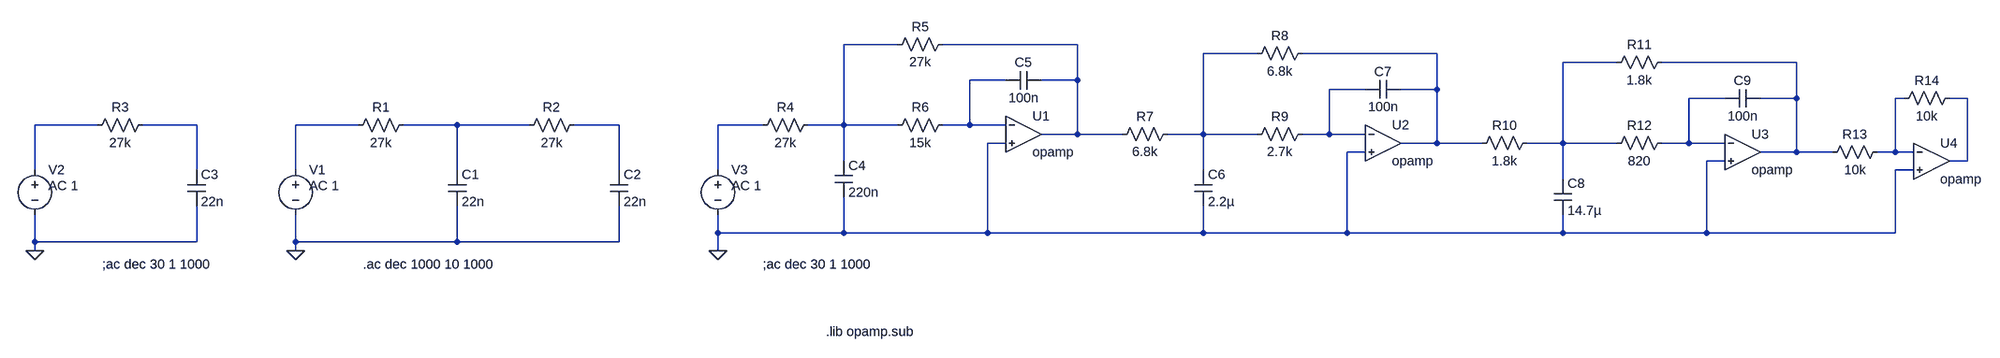
[diagram p0: schematic Cheybshev_3_Stage_Filter.asc]
Cheybshev_3_Stage_Filter.asc, the LTspice schematic file:
Version 4
SHEET 1 2932 680
WIRE 1024 -352 928 -352
WIRE 1344 -352 1104 -352
WIRE 1664 -336 1568 -336
WIRE 1984 -336 1744 -336
WIRE 2304 -320 2208 -320
WIRE 2624 -320 2384 -320
WIRE 1216 -288 1152 -288
WIRE 1344 -288 1344 -352
WIRE 1344 -288 1280 -288
WIRE 1856 -272 1792 -272
WIRE 1984 -272 1984 -336
WIRE 1984 -272 1920 -272
WIRE 2496 -256 2432 -256
WIRE 2624 -256 2624 -320
WIRE 2624 -256 2560 -256
WIRE 2816 -256 2800 -256
WIRE 2928 -256 2896 -256
WIRE -400 -208 -512 -208
WIRE -224 -208 -320 -208
WIRE 64 -208 -48 -208
WIRE 240 -208 144 -208
WIRE 368 -208 240 -208
WIRE 528 -208 448 -208
WIRE 784 -208 704 -208
WIRE 928 -208 928 -352
WIRE 928 -208 864 -208
WIRE 1024 -208 928 -208
WIRE 1152 -208 1152 -288
WIRE 1152 -208 1104 -208
WIRE 1216 -208 1152 -208
WIRE 1344 -192 1344 -288
WIRE 1344 -192 1280 -192
WIRE 1424 -192 1344 -192
WIRE 1568 -192 1568 -336
WIRE 1568 -192 1504 -192
WIRE 1664 -192 1568 -192
WIRE 1792 -192 1792 -272
WIRE 1792 -192 1744 -192
WIRE 1856 -192 1792 -192
WIRE 1216 -176 1184 -176
WIRE 1984 -176 1984 -272
WIRE 1984 -176 1920 -176
WIRE 2064 -176 1984 -176
WIRE 2208 -176 2208 -320
WIRE 2208 -176 2144 -176
WIRE 2304 -176 2208 -176
WIRE 2432 -176 2432 -256
WIRE 2432 -176 2384 -176
WIRE 2496 -176 2432 -176
WIRE 1856 -160 1824 -160
WIRE 2624 -160 2624 -256
WIRE 2624 -160 2560 -160
WIRE 2688 -160 2624 -160
WIRE 2800 -160 2800 -256
WIRE 2800 -160 2768 -160
WIRE 2832 -160 2800 -160
WIRE 928 -144 928 -208
WIRE 2496 -144 2464 -144
WIRE 2928 -144 2928 -256
WIRE 2928 -144 2896 -144
WIRE -512 -128 -512 -208
WIRE -224 -128 -224 -208
WIRE -48 -128 -48 -208
WIRE 240 -128 240 -208
WIRE 528 -128 528 -208
WIRE 704 -128 704 -208
WIRE 1568 -128 1568 -192
WIRE 2832 -128 2800 -128
WIRE 2208 -112 2208 -176
WIRE 704 -16 704 -48
WIRE 928 -16 928 -80
WIRE 928 -16 704 -16
WIRE 1184 -16 1184 -176
WIRE 1184 -16 928 -16
WIRE 1568 -16 1568 -64
WIRE 1568 -16 1184 -16
WIRE 1824 -16 1824 -160
WIRE 1824 -16 1568 -16
WIRE 2208 -16 2208 -48
WIRE 2208 -16 1824 -16
WIRE 2464 -16 2464 -144
WIRE 2464 -16 2208 -16
WIRE 2800 -16 2800 -128
WIRE 2800 -16 2464 -16
WIRE -512 0 -512 -48
WIRE -224 0 -224 -64
WIRE -224 0 -512 0
WIRE -48 0 -48 -48
WIRE 240 0 240 -64
WIRE 240 0 -48 0
WIRE 528 0 528 -64
WIRE 528 0 240 0
WIRE -512 16 -512 0
WIRE -48 16 -48 0
WIRE 704 16 704 -16
FLAG -48 16 0
FLAG -512 16 0
FLAG 704 16 0
SYMBOL voltage -48 -144 R0
WINDOW 123 24 44 Left 2
WINDOW 39 0 0 Left 0
SYMATTR InstName V1
SYMATTR Value ""
SYMATTR Value2 AC 1
SYMBOL res 160 -224 R90
WINDOW 0 0 56 VBottom 2
WINDOW 3 32 56 VTop 2
SYMATTR InstName R1
SYMATTR Value 27k
SYMBOL cap 224 -128 R0
SYMATTR InstName C1
SYMATTR Value 22n
SYMBOL res 464 -224 R90
WINDOW 0 0 56 VBottom 2
WINDOW 3 32 56 VTop 2
SYMATTR InstName R2
SYMATTR Value 27k
SYMBOL cap 512 -128 R0
SYMATTR InstName C2
SYMATTR Value 22n
SYMBOL voltage -512 -144 R0
WINDOW 123 24 44 Left 2
WINDOW 39 0 0 Left 0
SYMATTR InstName V2
SYMATTR Value ""
SYMATTR Value2 AC 1
SYMBOL res -304 -224 R90
WINDOW 0 0 56 VBottom 2
WINDOW 3 32 56 VTop 2
SYMATTR InstName R3
SYMATTR Value 27k
SYMBOL cap -240 -128 R0
SYMATTR InstName C3
SYMATTR Value 22n
SYMBOL voltage 704 -144 R0
WINDOW 123 24 44 Left 2
WINDOW 39 0 0 Left 0
SYMATTR InstName V3
SYMATTR Value ""
SYMATTR Value2 AC 1
SYMBOL Opamps\\opamp 1248 -256 R0
SYMATTR InstName U1
SYMBOL res 880 -224 R90
WINDOW 0 0 56 VBottom 2
WINDOW 3 32 56 VTop 2
SYMATTR InstName R4
SYMATTR Value 27k
SYMBOL cap 912 -144 R0
SYMATTR InstName C4
SYMATTR Value 220n
SYMBOL res 1120 -368 R90
WINDOW 0 0 56 VBottom 2
WINDOW 3 32 56 VTop 2
SYMATTR InstName R5
SYMATTR Value 27k
SYMBOL res 1120 -224 R90
WINDOW 0 0 56 VBottom 2
WINDOW 3 32 56 VTop 2
SYMATTR InstName R6
SYMATTR Value 15k
SYMBOL cap 1280 -304 R90
WINDOW 0 0 32 VBottom 2
WINDOW 3 32 32 VTop 2
SYMATTR InstName C5
SYMATTR Value 100n
SYMBOL Opamps\\opamp 1888 -240 R0
SYMATTR InstName U2
SYMBOL res 1520 -208 R90
WINDOW 0 0 56 VBottom 2
WINDOW 3 32 56 VTop 2
SYMATTR InstName R7
SYMATTR Value 6.8k
SYMBOL cap 1552 -128 R0
SYMATTR InstName C6
SYMATTR Value 2.2µ
SYMBOL res 1760 -352 R90
WINDOW 0 0 56 VBottom 2
WINDOW 3 32 56 VTop 2
SYMATTR InstName R8
SYMATTR Value 6.8k
SYMBOL res 1760 -208 R90
WINDOW 0 0 56 VBottom 2
WINDOW 3 32 56 VTop 2
SYMATTR InstName R9
SYMATTR Value 2.7k
SYMBOL cap 1920 -288 R90
WINDOW 0 0 32 VBottom 2
WINDOW 3 32 32 VTop 2
SYMATTR InstName C7
SYMATTR Value 100n
SYMBOL Opamps\\opamp 2528 -224 R0
SYMATTR InstName U3
SYMBOL res 2160 -192 R90
WINDOW 0 0 56 VBottom 2
WINDOW 3 32 56 VTop 2
SYMATTR InstName R10
SYMATTR Value 1.8k
SYMBOL cap 2192 -112 R0
SYMATTR InstName C8
SYMATTR Value 14.7µ
SYMBOL res 2400 -336 R90
WINDOW 0 0 56 VBottom 2
WINDOW 3 32 56 VTop 2
SYMATTR InstName R11
SYMATTR Value 1.8k
SYMBOL res 2400 -192 R90
WINDOW 0 0 56 VBottom 2
WINDOW 3 32 56 VTop 2
SYMATTR InstName R12
SYMATTR Value 820
SYMBOL cap 2560 -272 R90
WINDOW 0 0 32 VBottom 2
WINDOW 3 32 32 VTop 2
SYMATTR InstName C9
SYMATTR Value 100n
SYMBOL Opamps\\opamp 2864 -208 R0
SYMATTR InstName U4
SYMBOL res 2784 -176 R90
WINDOW 0 0 56 VBottom 2
WINDOW 3 32 56 VTop 2
SYMATTR InstName R13
SYMATTR Value 10k
SYMBOL res 2912 -272 R90
WINDOW 0 0 56 VBottom 2
WINDOW 3 32 56 VTop 2
SYMATTR InstName R14
SYMATTR Value 10k
TEXT 72 40 Left 2 !.ac dec 1000 10 1000
TEXT -392 40 Left 2 !;ac dec 30 1 1000
TEXT 896 160 Left 2 !.lib opamp.sub
TEXT 784 40 Left 2 !;ac dec 30 1 1000

The netlist it stands for:
* Cheybshev_3_Stage_Filter.asc
V1 N014 0 AC 1
R1 N015 N014 27k
C1 N015 0 22n
R2 N016 N015 27k
C2 N016 0 22n
V2 N012 0 AC 1
R3 N013 N012 27k
C3 N013 0 22n
V3 N017 0 AC 1
XU1 N007 0 N002 opamp Aol=100K GBW=10Meg  ; pins invin noninvin out
R4 N001 N017 27k
C4 N001 0 220n
R5 N002 N001 27k
R6 N007 N001 15k
C5 N002 N007 100n
XU2 N008 0 N004 opamp Aol=100K GBW=10Meg  ; pins invin noninvin out
R7 N003 N002 6.8k
C6 N003 0 2.2µ
R8 N004 N003 6.8k
R9 N008 N003 2.7k
C7 N004 N008 100n
XU3 N009 0 N006 opamp Aol=100K GBW=10Meg  ; pins invin noninvin out
R10 N005 N004 1.8k
C8 N005 0 14.7µ
R11 N006 N005 1.8k
R12 N009 N005 820
C9 N006 N009 100n
XU4 N010 0 N011 opamp Aol=100K GBW=10Meg  ; pins invin noninvin out
R13 N010 N006 10k
R14 N011 N010 10k
.ac dec 1000 10 1000
;ac dec 30 1 1000
.lib opamp.sub
;ac dec 30 1 1000
.backanno
.end